# Altium project MP3_Player.PrjPcb
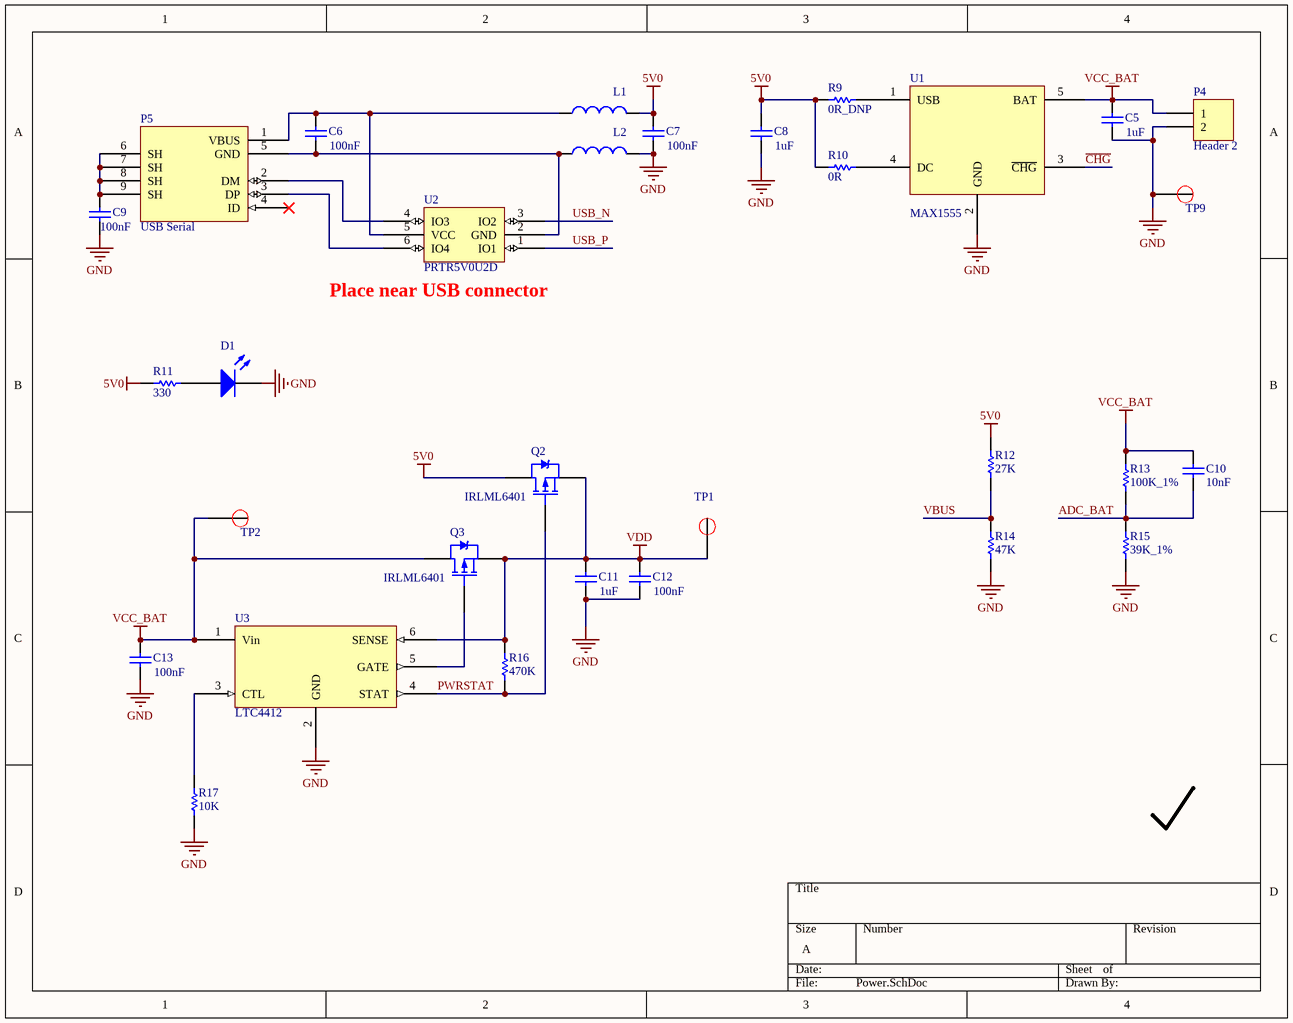
[diagram p0: Power.SchDoc]
3 sheets, 91 parts. Net scope: global (net labels, ports and power ports of the same name join across sheets).
Board file: MP3_Player.PcbDoc
Sheets:
  Power.SchDoc
  µC.SchDoc
  Interfaces.SchDoc

## Sheet Power.SchDoc
size A

### Parts
C5  value 1uF  [0603PKG]  (hidden comment: Cap)
C6  value 100nF  [C0805]  (hidden comment: Cap)
C7  value 100nF  [C0805]  (hidden comment: Cap)
C8  value 1uF  [0603PKG]  (hidden comment: Cap)
C9  value 100nF  [C0805]  (hidden comment: Cap)
C10  value 10nF  [0603PKG]  (hidden comment: Cap Semi)
C11  value 1uF  [0603PKG]  (hidden comment: Cap)
C12  value 100nF  [0603PKG]  (hidden comment: Cap)
C13  value 100nF  [0603PKG]  (hidden comment: Cap)
D1  LED0  [C0805]  (value not drawn)
L1  Ferrite Bead  [C0805]  (value not drawn)
L2  Ferrite Bead  [C0805]  (value not drawn)
P4  Header 2  [XH_2Pin_RA]
P5  USB Serial  [Mini USB]
Q2  IRLML6401  [SOT23]
Q3  IRLML6401  [SOT23]
R9  value 0R_DNP  [0603PKG]  (hidden comment: Res Semi)
R10  value 0R  [0603PKG]  (hidden comment: Res Semi)
R11  value 330  [0603PKG]  (hidden comment: Res Semi)
R12  value 27K  [0603PKG]  (hidden comment: Res Semi)
R13  value 100K_1%  [0603PKG]  (hidden comment: Res Semi)
R14  value 47K  [0603PKG]  (hidden comment: Res Semi)
R15  value 39K_1%  [0603PKG]  (hidden comment: Res Semi)
R16  value 470K  [0603PKG]  (hidden comment: Res Semi)
R17  value 10K  [0603PKG]  (hidden comment: Res Semi)
TP1  TP  [TP_15]  (value not drawn)
TP2  TP  [TP_15]  (value not drawn)
TP9  TP  [TP_15]  (value not drawn)
U1  MAX1555  [SOT23-5]
U2  PRTR5V0U2D  [SOT457]
U3  LTC4412  [SOT23-6]

### Nets
5V0: C7.2 C8.2 L1.2 Q2.3(D) R9.1 R10.1 R11.2 R12.2
GND: C5.1 C7.1 C8.1 C9.1 C11.1 C12.1 C13.1 D1.2(K) L2.2 P4.2 R14.1 R15.1 R17.1 TP9.1 U1.2(GND) U3.2(GND)
VCC_BAT: C5.2 C10.1 C13.2 P4.1 Q3.3(D) R13.2 TP2.1 U1.5(BAT) U3.1(Vin)
VDD: C11.2 C12.2 Q2.2(S) Q3.2(S) R16.2 TP1.1 U3.6(SENSE)
ADC_BAT: C10.2 R13.1 R15.2
~{CHG}: U1.3(~{CHG})
PWRSTAT: Q2.1(G) R16.1 U3.4(STAT)
USB_N: U2.3(IO2)
USB_P: U2.1(IO1)
VBUS: R12.1 R14.2
NetC6_1: C6.1 L2.1 P5.5(GND) U2.2(GND)
NetC6_2: C6.2 L1.1 P5.1(VBUS) U2.5(VCC)
NetC9_2: C9.2 P5.6(SH) P5.7(SH) P5.8(SH) P5.9(SH)
NetD1_1: D1.1(A) R11.1
NetP5_2: P5.2(DM) U2.4(IO3)
NetP5_3: P5.3(DP) U2.6(IO4)
NetQ3_1: Q3.1(G) U3.5(GATE)
NetR9_2: R9.2 U1.1(USB)
NetR10_2: R10.2 U1.4(DC)
NetR17_2: R17.2 U3.3(CTL)

Not connected (* = marked no-connect by the designer): P5 4(ID)*

### Notes on the sheet
- (near U2) Place near USB connector

### Library data of the parts
C5-C9 C11-C13 = Cap: Capacitor; Published: 8-Jun-2000; LatestRevisionDate: 17-Jul-2002; LatestRevisionNote: Re-released for DXP Platform.; PackageReference: RAD-0.3; Publisher: Altium Limited; PackageDescription: Radial Cap, Thru-Hole; 2 Leads; 0.3 in Pin Spacing
C10 = Cap Semi: Capacitor (Semiconductor SIM Model); Published: 8-Jun-2000; LatestRevisionDate: 29-May-2009; LatestRevisionNote: IPC-7351 Footprint Added.; PackageReference: C1206; Publisher: Altium Limited; PackageDescription: Chip Capacitor
D1 = LED0: Typical INFRARED GaAs LED; Published: 8-Jun-2000; LatestRevisionDate: 08-Jul-2005; LatestRevisionNote: Mech Layer 1 removed.; PackageReference: LED-0; Publisher: Altium Limited; PackageDescription: LED; 2 Leads
L1 L2 = Inductor: Code_IEC: 1005; Value: 10mH; Published: 8-Jun-2000; LatestRevisionDate: 29-May-2009; LatestRevisionNote: IPC-7351 Footprint Added.; PackageReference: 0402-A; Publisher: Altium Limited; PackageDescription: Chip Inductor; Code_JEITA: 0402
P4 = Header 2: Header, 2-Pin; LatestRevisionDate: 17-Jul-2002; LatestRevisionNote: Re-released for DXP Platform.; Publisher: Altium Limited
P5 = Mini USB
Q2 Q3 = PMOS-2: P-Channel Power MOSFET; Note: Pin 4 not drawn and electrically connected to Pin 2.; Published: 8-Jun-2000; LatestRevisionDate: 17-Jul-2002; LatestRevisionNote: Re-released for DXP Platform.; DatasheetVersion: PD-9.390D; PackageVersion: Feb-1997; PackageReference: TO-220AB; Publisher: Altium Limited; PackageDescription: TO, Thru-Hole, Vertical, Heatsink Mounted; 3 In-Line Leads; Pitch 2.54 mm; ComponentLink1Description: Manufacturer Link; ComponentLink1URL: http://www.irf.com/
R9-R17 = Res Semi: Semiconductor Resistor; Published: 8-Jun-2000; LatestRevisionDate: 17-Jul-2002; LatestRevisionNote: Re-released for DXP Platform.; PackageReference: AXIAL-0.5; Publisher: Altium Limited; PackageDescription: Axial Device, Thru-Hole; 2 Leads; 0.5 in Pin Spacing
TP1 TP2 TP9 = Test Point
U1 = MAX1555: 1-Cell Li+  Battery Chargers
U2 = PRTR5V0U2D: TVS Zener
U3 = LTC4412: Low Loss PowerPath™  Controller in ThinSOT

## Sheet µC.SchDoc
size A
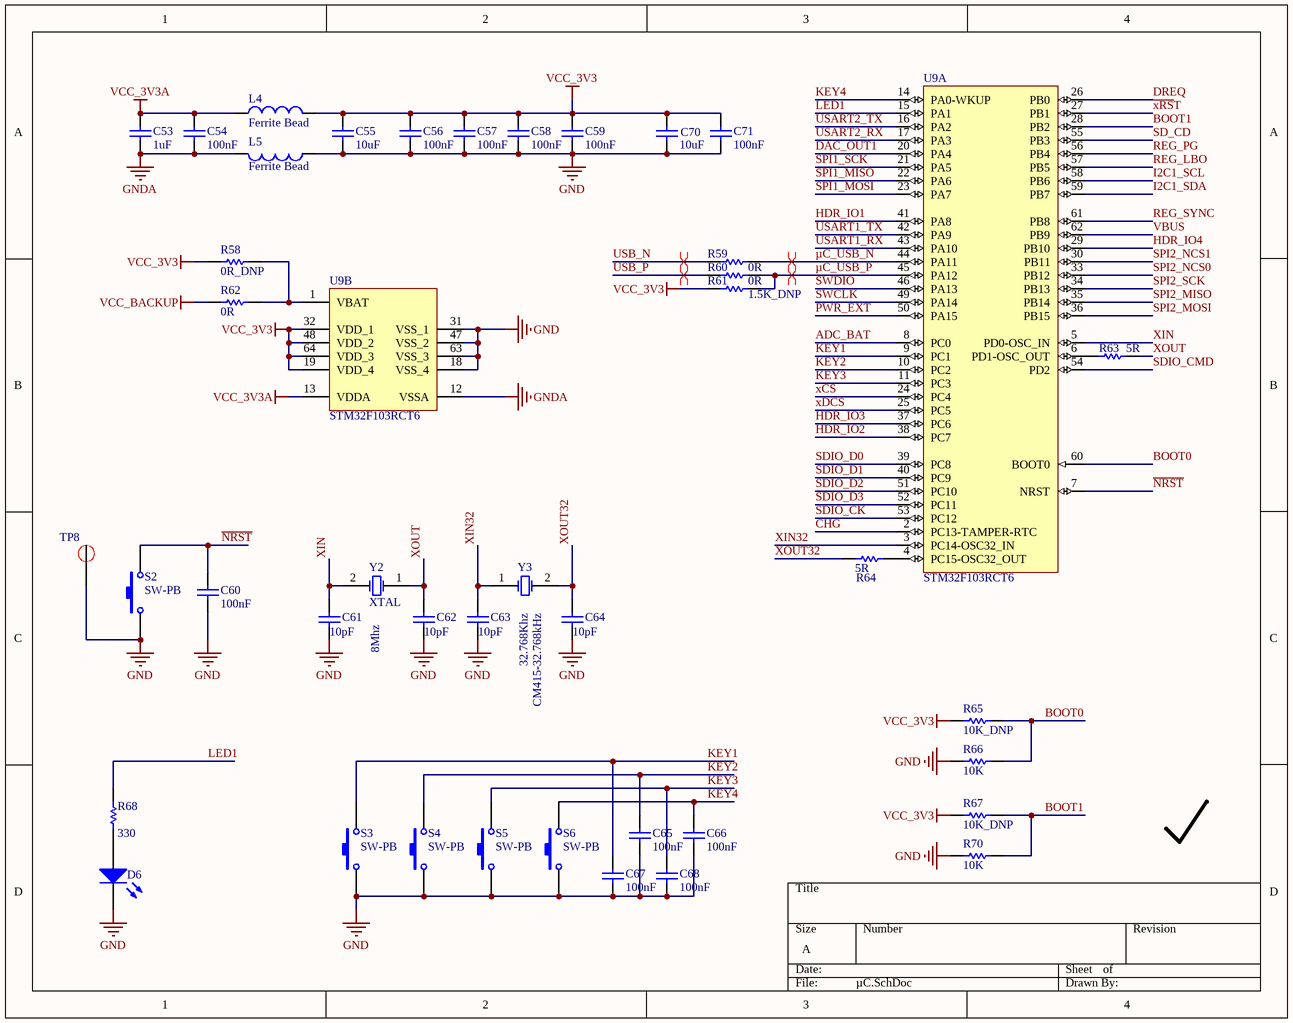
[diagram p1: µC.SchDoc]

### Parts
C53  value 1uF  [0603PKG]  (hidden comment: Cap Semi)
C54  value 100nF  [0603PKG]  (hidden comment: Cap Semi)
C55  value 10uF  [0603PKG]  (hidden comment: Cap Semi)
C56  value 100nF  [0603PKG]  (hidden comment: Cap Semi)
C57  value 100nF  [0603PKG]  (hidden comment: Cap Semi)
C58  value 100nF  [0603PKG]  (hidden comment: Cap Semi)
C59  value 100nF  [0603PKG]  (hidden comment: Cap Semi)
C60  value 100nF  [0603PKG]  (hidden comment: Cap Semi)
C61  value 10pF  [0603PKG]  (hidden comment: Cap)
C62  value 10pF  [0603PKG]  (hidden comment: Cap)
C63  value 10pF  [0603PKG]  (hidden comment: Cap)
C64  value 10pF  [0603PKG]  (hidden comment: Cap)
C65  value 100nF  [0603PKG]  (hidden comment: Cap Semi)
C66  value 100nF  [0603PKG]  (hidden comment: Cap Semi)
C67  value 100nF  [0603PKG]  (hidden comment: Cap Semi)
C68  value 100nF  [0603PKG]  (hidden comment: Cap Semi)
C70  value 10uF  [C0805]  (hidden comment: Cap Semi)
C71  value 100nF  [C0805]  (hidden comment: Cap Semi)
D6  LED0  [C0805]  (value not drawn)
L4  Ferrite Bead  [C0805]
L5  Ferrite Bead  [C0805]
R58  value 0R_DNP  [0603PKG]  (hidden comment: Res1)
R59  value 0R  [0603PKG]  (hidden comment: Res1)
R60  value 0R  [0603PKG]  (hidden comment: Res1)
R61  value 1.5K_DNP  [0603PKG]  (hidden comment: Res1)
R62  value 0R  [0603PKG]  (hidden comment: Res1)
R63  value 5R  [0603PKG]  (hidden comment: Res1)
R64  value 5R  [0603PKG]  (hidden comment: Res1)
R65  value 10K_DNP  [0603PKG]  (hidden comment: Res1)
R66  value 10K  [0603PKG]  (hidden comment: Res1)
R67  value 10K_DNP  [0603PKG]  (hidden comment: Res1)
R68  value 330  [0603PKG]  (hidden comment: Res Semi)
R70  value 10K  [0603PKG]  (hidden comment: Res1)
S2  SW-PB  [SMD push button]
S3  SW-PB  [SMD push button]
S4  SW-PB  [SMD push button]
S5  SW-PB  [SMD push button]
S6  SW-PB  [SMD push button]
TP8  TP  [TP_15]  (value not drawn)
U9  STM32F103RCT6  [LQFP64]  (parts A,B of 2)
Y2  XTAL  value 8Mhz  [SMD_Crystal]
Y3  CM415-32.768kHz  value 32.768Khz  [CM415]

### Nets
GND: C55.1 C56.1 C57.1 C58.1 C59.1 C60.1 C61.1 C62.1 C63.1 C64.1 C65.1 C66.1 C67.1 C68.1 C70.1 C71.1 D6.2(K) L5.1 R66.2 R70.2 S2.1 S3.1 S4.1 S5.1 S6.1 TP8.1 U9.18(VSS_4) U9.31(VSS_1) U9.47(VSS_2) U9.63(VSS_3)
GNDA: C53.1 C54.1 L5.2 U9.12(VSSA)
VCC_3V3: C55.2 C56.2 C57.2 C58.2 C59.2 C70.2 C71.2 L4.2 R58.2 R61.2 R65.2 R67.2 U9.19(VDD_4) U9.32(VDD_1) U9.48(VDD_2) U9.64(VDD_3)
VCC_3V3A: C53.2 C54.2 L4.1 U9.13(VDDA)
VCC_BACKUP: R62.2
ADC_BAT: U9.8(PC0)
BOOT0: R65.1 R66.1 U9.60(BOOT0)
BOOT1: R67.1 R70.1 U9.28(PB2)
~{CHG}: U9.2(PC13-TAMPER-RTC)
DAC_OUT1: U9.20(PA4)
DREQ: U9.26(PB0)
HDR_IO1: U9.41(PA8)
HDR_IO2: U9.38(PC7)
HDR_IO3: U9.37(PC6)
HDR_IO4: U9.29(PB10)
I2C1_SCL: U9.58(PB6)
I2C1_SDA: U9.59(PB7)
KEY1: C67.2 S3.2 U9.9(PC1)
KEY2: C65.2 S4.2 U9.10(PC2)
KEY3: C68.2 S5.2 U9.11(PC3)
KEY4: C66.2 S6.2 U9.14(PA0-WKUP)
LED1: R68.2 U9.15(PA1)
~{NRST}: C60.2 S2.2 U9.7(NRST)
PWR_EXT: U9.50(PA15)
REG_LBO: U9.57(PB5)
REG_PG: U9.56(PB4)
REG_SYNC: U9.61(PB8)
SD_CD: U9.55(PB3)
SDIO_CK: U9.53(PC12)
SDIO_CMD: U9.54(PD2)
SDIO_D0: U9.39(PC8)
SDIO_D1: U9.40(PC9)
SDIO_D2: U9.51(PC10)
SDIO_D3: U9.52(PC11)
SPI1_MISO: U9.22(PA6)
SPI1_MOSI: U9.23(PA7)
SPI1_SCK: U9.21(PA5)
SPI2_MISO: U9.35(PB14)
SPI2_MOSI: U9.36(PB15)
SPI2_NCS0: U9.33(PB12)
SPI2_NCS1: U9.30(PB11)
SPI2_SCK: U9.34(PB13)
SWCLK: U9.49(PA14)
SWDIO: U9.46(PA13)
USART1_RX: U9.43(PA10)
USART1_TX: U9.42(PA9)
USART2_RX: U9.17(PA3)
USART2_TX: U9.16(PA2)
USB_N: R59.2
USB_P: R60.2
VBUS: U9.62(PB9)
~{xCS}: U9.24(PC4)
~{xDCS}: U9.25(PC5)
~{xRS}T: U9.27(PB1)
XIN: C61.2 U9.5(PD0-OSC_IN) Y2.2(OSC2)
XIN32: C63.2 U9.3(PC14-OSC32_IN) Y3.1(OSC1)
XOUT: C62.2 R63.1 Y2.1(OSC1)
XOUT32: C64.2 R64.2 Y3.2(OSC2)
µC_USB_N: R59.1 U9.44(PA11)
µC_USB_P: R60.1 R61.1 U9.45(PA12)
NetD6_1: D6.1(A) R68.1
NetR58_1: R58.1 R62.1 U9.1(VBAT)
NetR63_2: R63.2 U9.6(PD1-OSC_OUT)
NetR64_1: R64.1 U9.4(PC15-OSC32_OUT)

### Layout directives
differential pair: USB_N, USB_P, µC_USB_N, µC_USB_P

### Library data of the parts
C53-C60 C65-C68 C70 C71 = Cap Semi: Capacitor (Semiconductor SIM Model); Published: 8-Jun-2000; LatestRevisionDate: 29-May-2009; LatestRevisionNote: IPC-7351 Footprint Added.; PackageReference: C1206; Publisher: Altium Limited; PackageDescription: Chip Capacitor
C61-C64 = Cap: Capacitor; Published: 8-Jun-2000; LatestRevisionDate: 17-Jul-2002; LatestRevisionNote: Re-released for DXP Platform.; PackageReference: RAD-0.3; Publisher: Altium Limited; PackageDescription: Radial Cap, Thru-Hole; 2 Leads; 0.3 in Pin Spacing
D6 = LED0: Typical INFRARED GaAs LED; Published: 8-Jun-2000; LatestRevisionDate: 08-Jul-2005; LatestRevisionNote: Mech Layer 1 removed.; PackageReference: LED-0; Publisher: Altium Limited; PackageDescription: LED; 2 Leads
L4 L5 = Inductor: Code_IEC: 1005; Value: 10mH; Published: 8-Jun-2000; LatestRevisionDate: 29-May-2009; LatestRevisionNote: IPC-7351 Footprint Added.; PackageReference: 0402-A; Publisher: Altium Limited; PackageDescription: Chip Inductor; Code_JEITA: 0402
R58-R67 R70 = Res1: Resistor; Published: 8-Jun-2000; LatestRevisionDate: 17-Jul-2002; LatestRevisionNote: Re-released for DXP Platform.; PackageReference: AXIAL-0.3; Publisher: Altium Limited; PackageDescription: Axial Device, Thru-Hole; 2 Leads; 0.3 in Pin Spacing
R68 = Res Semi: Semiconductor Resistor; Published: 8-Jun-2000; LatestRevisionDate: 17-Jul-2002; LatestRevisionNote: Re-released for DXP Platform.; PackageReference: AXIAL-0.5; Publisher: Altium Limited; PackageDescription: Axial Device, Thru-Hole; 2 Leads; 0.5 in Pin Spacing
S2-S6 = SW-PB: Switch; Published: 24-Mar-1999; LatestRevisionDate: 17-Jul-2002; LatestRevisionNote: Re-released for DXP Platform.; PackageReference: SPST-2; Publisher: Altium Limited; PackageDescription: Switch; 2 Leads
TP8 = Test Point
U9 = STM32F103RCT6: ARM Cortex-M3 32-bit MCU, 256 KB Flash, 48 KB Internal RAM, 51 I/Os, 64-pin LQFP, -40 to 85 degC, Tray; A/D Converter: 3x12-bit (16 Channel); D/A Converter: 2x12-bit (2 Channel); FLASH Size (Prog) (kB): 256; I/Os (High Current): 51; Internal RAM Size (kB): 48; Operating Frequency(F) (Processor speed) (MHz): 72; Supply Voltage(Vcc) min (V): 2; DatasheetVersion: Rev. 8; PackageVersion: Rev. 4, 06/2013; PackageReference: LQFP64; PackageDescription: 64-Pin Low Profile Quad Flat Package, 10 x 10 mm Body, 0.5 mm Pitch; Supplier 1: Digi-Key; Supplier Part Number 1: 497-9033-ND; Supplier 2: Newark; Supplier Part Number 2: 01P4099; Supplier 3: Newark; Supplier Part Number 3: 57P1227; Supplier 4: Mouser; Supplier Part Number 4: 511-STM32F103RCT6; Core: ARM Cortex-M3; Packing: Tray; Mounting Technology: Surface Mount; PartNumber: STM32F103RCT6; ComponentLink1Description: Manufacturer URL; ComponentLink1URL: http://www.st.com/web/en/home.html; ComponentLink2Description: Datasheet; ComponentLink2URL: http://www.st.com/st-web-ui/static/active/en/resource/technical/document/datasheet/CD00191185.pdf; ComponentLink3Description: Package Specification; ComponentLink3URL: http://www.st.com/st-web-ui/static/active/en/resource/technical/document/datasheet/DM00037051.pdf
Y2 = XTAL: Crystal Oscillator; Published: 8-Jun-2000; LatestRevisionDate: 17-Jul-2002; LatestRevisionNote: Re-released for DXP Platform.; PackageReference: R38; Publisher: Altium Limited; PackageDescription: Crystal, Thru-Hole; 2 Leads; Body 3.1 x 8.2 mm (Dia.xH)
Y3 = XTAL: Crystal Oscillator CM415-32.768kHz; Published: 8-Jun-2000; LatestRevisionDate: 17-Jul-2002; LatestRevisionNote: Re-released for DXP Platform.; PackageReference: R38; Publisher: Altium Limited; PackageDescription: Crystal, Thru-Hole; 2 Leads; Body 3.1 x 8.2 mm (Dia.xH)

## Sheet Interfaces.SchDoc
size A
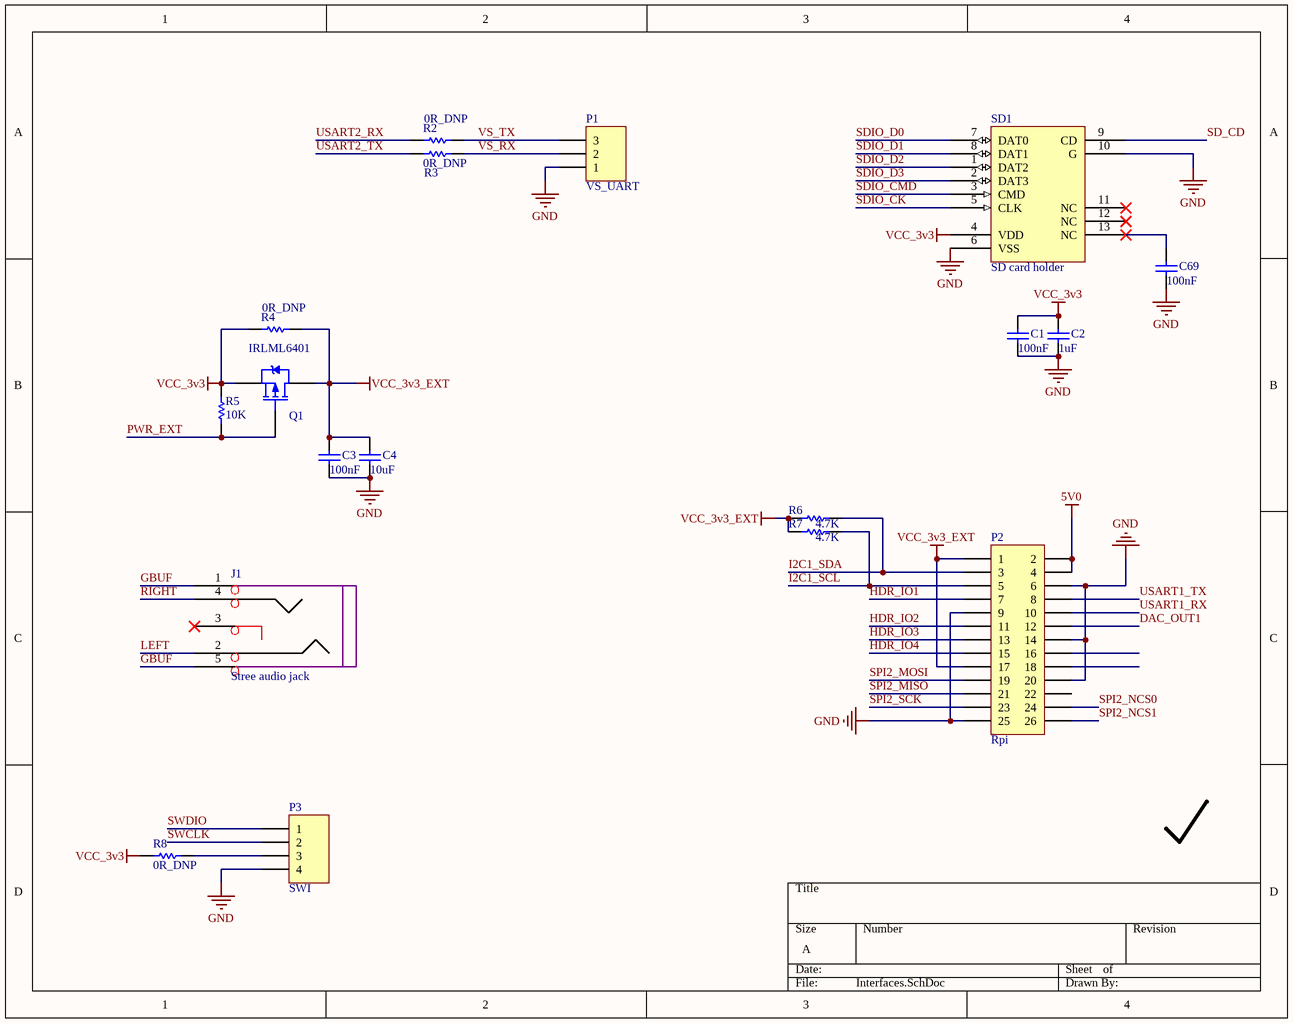
[diagram p2: Interfaces.SchDoc]

### Parts
C1  value 100nF  [0603PKG]  (hidden comment: Cap)
C2  value 1uF  [0603PKG]  (hidden comment: Cap)
C3  value 100nF  [0603PKG]  (hidden comment: Cap)
C4  value 10uF  [0603PKG]  (hidden comment: Cap)
C69  value 100nF  [0603PKG]  (hidden comment: Cap)
J1  Stree audio jack  [Audio Jack]
P1  VS_UART  [XH_3Pin_RA]
P2  Rpi  [HDR2X13]
P3  SWI  [XH_4Pin_RA]
Q1  IRLML6401  [SOT23]
R2  value 0R_DNP  [0603PKG]  (hidden comment: Res1)
R3  value 0R_DNP  [0603PKG]  (hidden comment: Res1)
R4  value 0R_DNP  [0603PKG]  (hidden comment: Res1)
R5  value 10K  [0603PKG]  (hidden comment: Res1)
R6  value 4.7K  [0603PKG]  (hidden comment: Res1)
R7  value 4.7K  [0603PKG]  (hidden comment: Res1)
R8  value 0R_DNP  [0603PKG]  (hidden comment: Res1)
SD1  SD card holder  [MicroSD socket]

### Nets
5V0: P2.2 P2.4
GND: C1.1 C2.1 C3.1 C4.1 C69.1 P1.1 P2.6 P2.9 P2.14 P2.20 P2.25 P3.4 SD1.6(VSS) SD1.10(G)
VCC_3V3: C1.2 C2.2 Q1.2(S) R4.1 R5.1 R8.1 SD1.4(VDD)
VCC_3v3_EXT: C3.2 C4.2 P2.1 P2.17 Q1.3(D) R4.2 R6.1 R7.1
DAC_OUT1: P2.12
GBUF: J1.1(GND) J1.5(GND)
HDR_IO1: P2.7
HDR_IO2: P2.11
HDR_IO3: P2.13
HDR_IO4: P2.15
I2C1_SCL: P2.5 R7.2
I2C1_SDA: P2.3 R6.2
LEFT: J1.2(LEFT)
PWR_EXT: Q1.1(G) R5.2
RIGHT: J1.4(RIGHT)
SD_CD: SD1.9(CD)
SDIO_CK: SD1.5(CLK)
SDIO_CMD: SD1.3(CMD)
SDIO_D0: SD1.7(DAT0)
SDIO_D1: SD1.8(DAT1)
SDIO_D2: SD1.1(DAT2)
SDIO_D3: SD1.2(DAT3)
SPI2_MISO: P2.21
SPI2_MOSI: P2.19
SPI2_NCS0: P2.24
SPI2_NCS1: P2.26
SPI2_SCK: P2.23
SWCLK: P3.2
SWDIO: P3.1
USART1_RX: P2.10
USART1_TX: P2.8
USART2_RX: R2.1
USART2_TX: R3.2
VS_RX: P1.2 R3.1
VS_TX: P1.3 R2.2
NetC69_2: C69.2 SD1.13(NC)
NetP3_3: P3.3 R8.2

Not connected (* = marked no-connect by the designer): J1 3(SW)*; P2 16 18 22; SD1 11(NC)* 12(NC)*

### Library data of the parts
C1-C4 C69 = Cap: Capacitor; Published: 8-Jun-2000; LatestRevisionDate: 17-Jul-2002; LatestRevisionNote: Re-released for DXP Platform.; PackageReference: RAD-0.3; Publisher: Altium Limited; PackageDescription: Radial Cap, Thru-Hole; 2 Leads; 0.3 in Pin Spacing
J1 = Audio Jack
P1 = Header 3: Header, 3-Pin; LatestRevisionDate: 17-Jul-2002; LatestRevisionNote: Re-released for DXP Platform.; Publisher: Altium Limited
P2 = Header 13X2: Header, 13-Pin, Dual row; LatestRevisionDate: 17-Jul-2002; LatestRevisionNote: Re-released for DXP Platform.; Publisher: Altium Limited
P3 = Header 4: Header, 4-Pin; LatestRevisionDate: 17-Jul-2002; LatestRevisionNote: Re-released for DXP Platform.; Publisher: Altium Limited
Q1 = PMOS-2: as Q2 on sheet Power; Published: 8-Jun-2000; LatestRevisionDate: 17-Jul-2002; LatestRevisionNote: Re-released for DXP Platform.; DatasheetVersion: PD-9.390D; PackageVersion: Feb-1997; PackageReference: TO-220AB; Publisher: Altium Limited; PackageDescription: TO, Thru-Hole, Vertical, Heatsink Mounted; 3 In-Line Leads; Pitch 2.54 mm; ComponentLink1Description: Manufacturer Link; ComponentLink1URL: http://www.irf.com/
R2-R8 = Res1: Resistor; Published: 8-Jun-2000; LatestRevisionDate: 17-Jul-2002; LatestRevisionNote: Re-released for DXP Platform.; PackageReference: AXIAL-0.3; Publisher: Altium Limited; PackageDescription: Axial Device, Thru-Hole; 2 Leads; 0.3 in Pin Spacing
SD1 = MicroSD_holder

## Nets that join several sheets
5V0: Power (8 pins), Interfaces (P2.2 P2.4)
GND: Power (16 pins), µC (30 pins), Interfaces (14 pins)
VCC_3V3: µC (16 pins), Interfaces (7 pins)
ADC_BAT: Power (C10.2 R13.1 R15.2), µC (U9.8)
~{CHG}: Power (U1.3), µC (U9.2)
DAC_OUT1: µC (U9.20), Interfaces (P2.12)
HDR_IO1: µC (U9.41), Interfaces (P2.7)
HDR_IO2: µC (U9.38), Interfaces (P2.11)
HDR_IO3: µC (U9.37), Interfaces (P2.13)
HDR_IO4: µC (U9.29), Interfaces (P2.15)
I2C1_SCL: µC (U9.58), Interfaces (P2.5 R7.2)
I2C1_SDA: µC (U9.59), Interfaces (P2.3 R6.2)
PWR_EXT: µC (U9.50), Interfaces (Q1.1 R5.2)
SD_CD: µC (U9.55), Interfaces (SD1.9)
SDIO_CK: µC (U9.53), Interfaces (SD1.5)
SDIO_CMD: µC (U9.54), Interfaces (SD1.3)
SDIO_D0: µC (U9.39), Interfaces (SD1.7)
SDIO_D1: µC (U9.40), Interfaces (SD1.8)
SDIO_D2: µC (U9.51), Interfaces (SD1.1)
SDIO_D3: µC (U9.52), Interfaces (SD1.2)
SPI2_MISO: µC (U9.35), Interfaces (P2.21)
SPI2_MOSI: µC (U9.36), Interfaces (P2.19)
SPI2_NCS0: µC (U9.33), Interfaces (P2.24)
SPI2_NCS1: µC (U9.30), Interfaces (P2.26)
SPI2_SCK: µC (U9.34), Interfaces (P2.23)
SWCLK: µC (U9.49), Interfaces (P3.2)
SWDIO: µC (U9.46), Interfaces (P3.1)
USART1_RX: µC (U9.43), Interfaces (P2.10)
USART1_TX: µC (U9.42), Interfaces (P2.8)
USART2_RX: µC (U9.17), Interfaces (R2.1)
USART2_TX: µC (U9.16), Interfaces (R3.2)
USB_N: Power (U2.3), µC (R59.2)
USB_P: Power (U2.1), µC (R60.2)
VBUS: Power (R12.1 R14.2), µC (U9.62)